# Altium schematic sheet Output.SchDoc
size A4
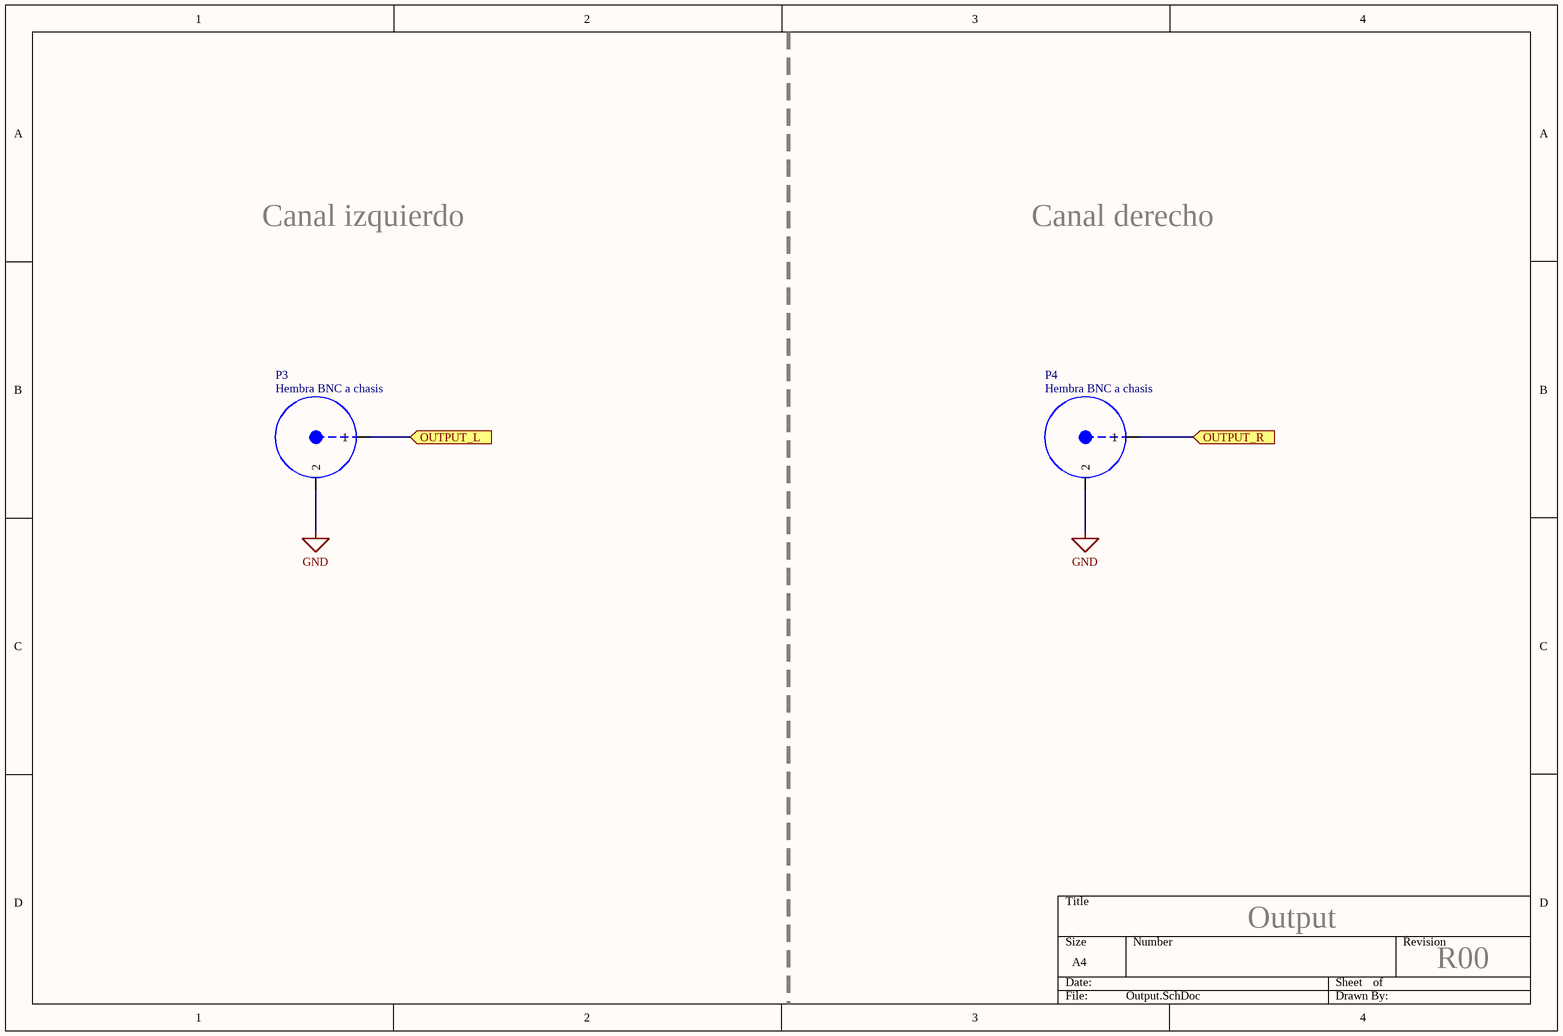
[diagram p0: Output.SchDoc]

## Parts
P3  Hembra BNC a chasis  [BNC_Ext]
P4  Hembra BNC a chasis  [BNC_Ext]

## Ports
OUTPUT_L (in), OUTPUT_R (in)

## Nets
GND: P3.2 P4.2
OUTPUT_L: P3.1 ; port OUTPUT_L
OUTPUT_R: P4.1 ; port OUTPUT_R

## Notes on the sheet
- Canal izquierdo
- Canal derecho
- Output
- R00

## Library data of the parts
P3 P4 = BNC: BNC connector; Cod. Proveedor: Consultar; Proveedor: Elemon